# EAGLE board BEP33_12panel stencil (EAGLE 7.7.0), part 1 of 8
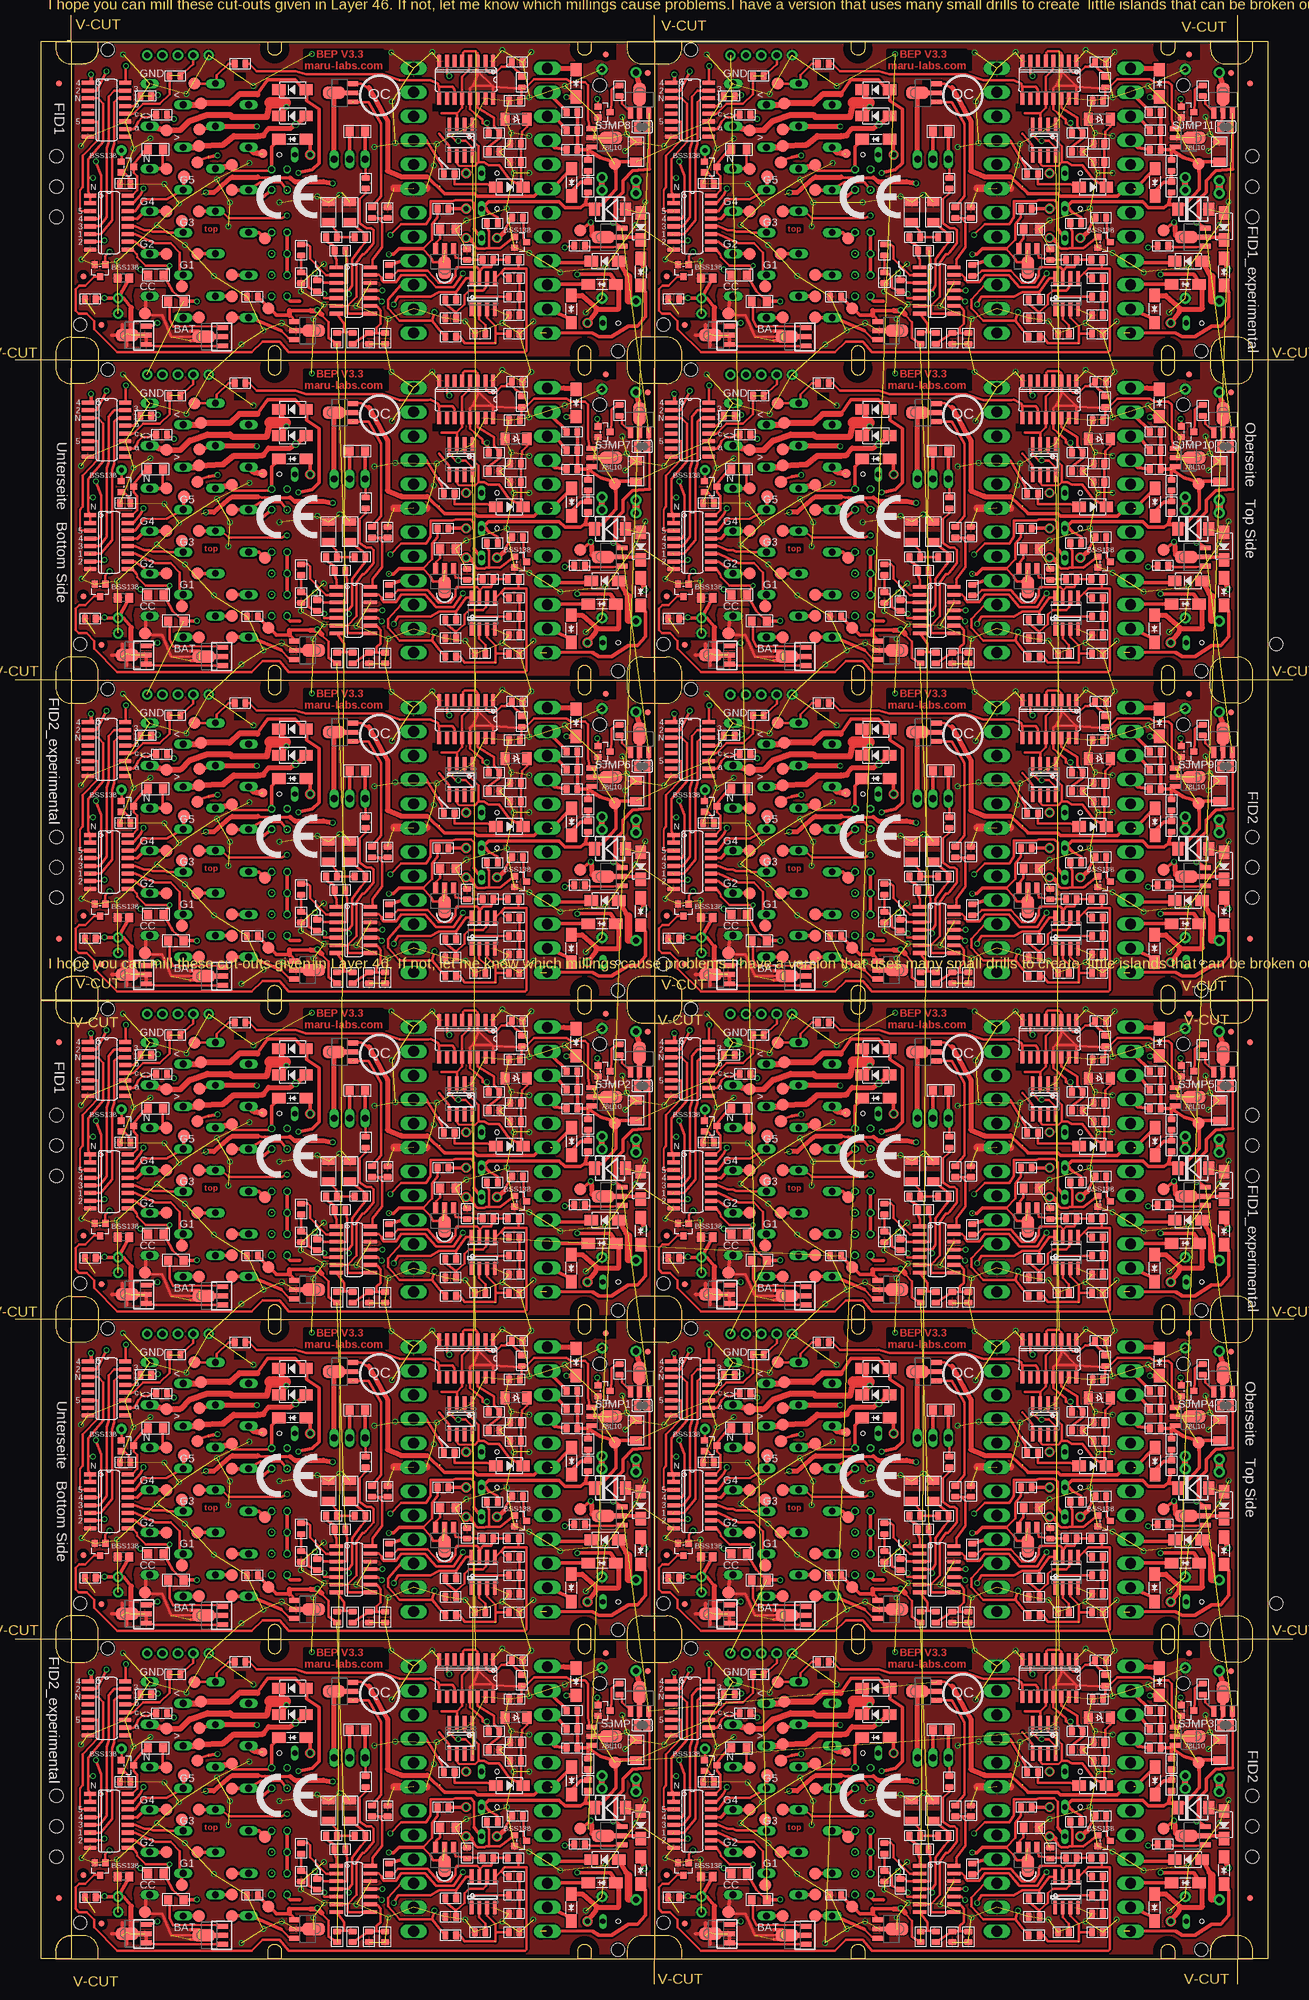
[diagram p26: board, top side]
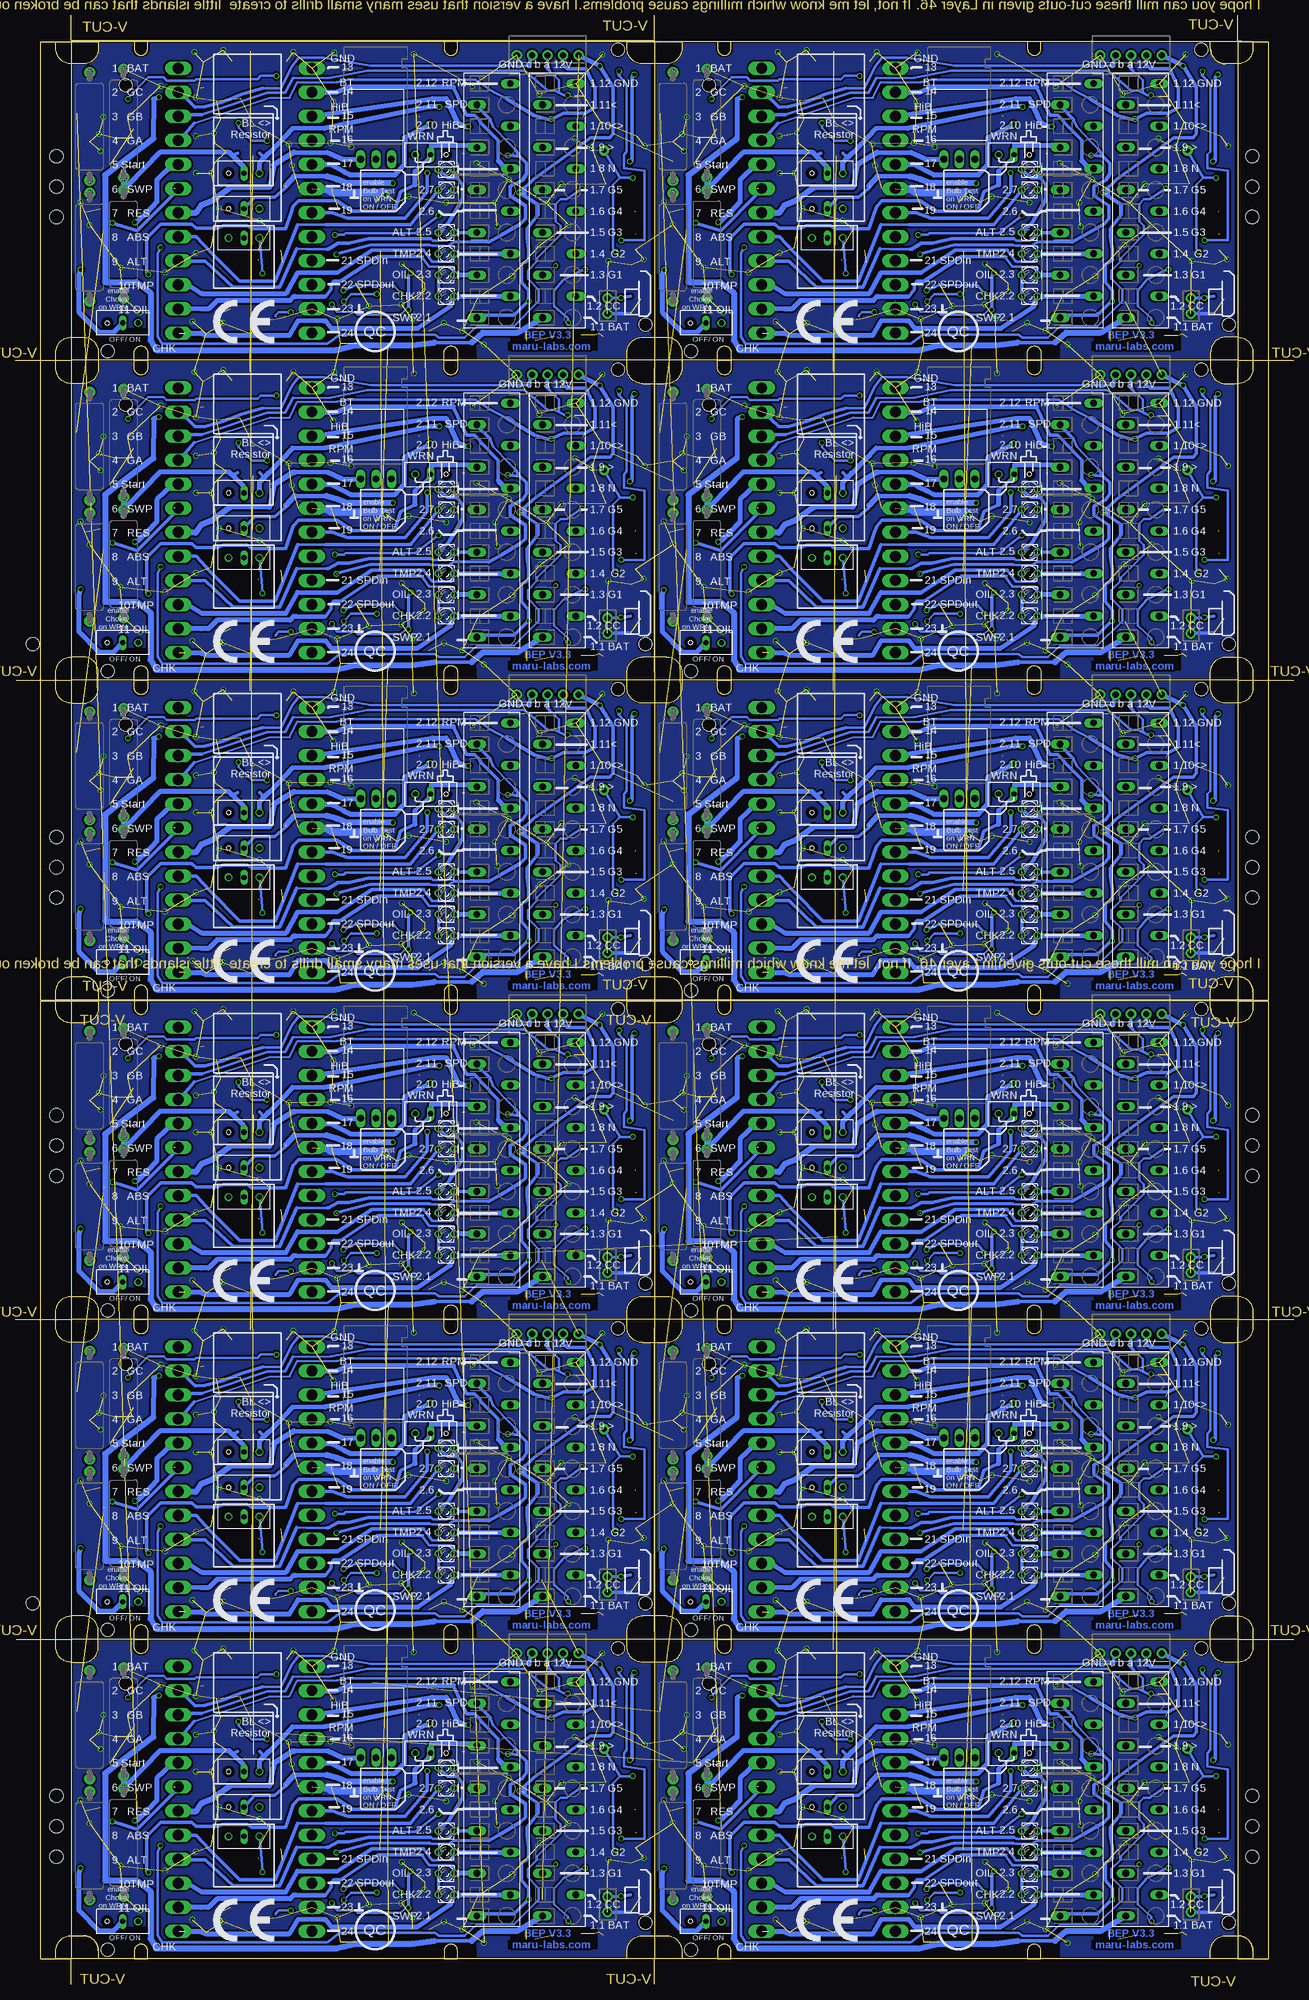
[diagram p27: board, bottom side, seen from below]

Size 210.4 x 324 mm. Coordinates in mm from the lower left corner, seen from the top.
Outline: 87 segments
Copper layers (1*16): Top 0.035mm / dielectric 1.5mm / Bottom 0.035mm
Design rules "Vorlage BEP3 und hoeher multi-cb_035um-cu": minimum track width 6mil, minimum drill 12mil, track to track 12mil, track to pad 12mil, pad to pad 6mil, via to via 6mil, smd to smd 6mil, copper to edge 10mil, drill to drill 8mil, minimum pad ring 8mil, minimum via ring 6mil, stop-mask expansion 3mil, vias tented up to drill 0mil, thermal gap 8mil
Holes 2.18 mm at 10.7,10.1 96.2,49.5 99.2,5.7 15.2,55.3 6.8,143 6.8,21 6.8,26 6.8,138 207.5,62.7 203.6,143 203.6,21 203.6,26 203.6,138 6.8,31 6.8,133 203.6,133 203.6,31 10.7,62.7 96.2,102.1 99.2,58.3 15.2,107.9 10.7,115.3 96.2,154.7 99.2,110.9 15.2,160.5 106.7,10.1 192.2,49.5 195.2,5.7 111.2,55.3 106.7,62.7 192.2,102.1 195.2,58.3 111.2,107.9 106.7,115.3 192.2,154.7 195.2,110.9 111.2,160.5 10.7,167.9 96.2,207.3 99.2,163.5 15.2,213.1 6.8,300.8 6.8,178.8 6.8,183.8 6.8,295.8 207.5,220.5 203.6,300.8 203.6,178.8 203.6,183.8 203.6,295.8 6.8,188.8 6.8,290.8 203.6,290.8 203.6,188.8 10.7,220.5 96.2,259.9 99.2,216.1 15.2,265.7 10.7,273.1 96.2,312.5 99.2,268.7 15.2,318.3 106.7,167.9 192.2,207.3 195.2,163.5 111.2,213.1 106.7,220.5 192.2,259.9 195.2,216.1 111.2,265.7 106.7,273.1 192.2,312.5 195.2,268.7 111.2,318.3
tRestrict: area 50.2,25.2 to 56.7,28.5; area 36,50.2 to 37.9,51.5; area 67.6,20.8 to 69.4,22.8; area 53.3,46.1 to 54.7,50.4; area 46.5,6.9 to 47.8,11.4; area 19.2,6.6 to 20.6,10.1; area 97.6,26.6 to 99.2,27.8; area 95.6,53.7 to 98.9,56.4; area 68.7,45.2 to 72.9,46.4; area 22.6,38.2 to 23.7,39.9; area 16.5,56.8 to 91.2,56.8; area 47.6,52 to 61.3,55.1; 204 more areas
bRestrict: area 18.6,5.8 to 28.8,9.3; area 28.7,5.8 to 33.3,7.3; area 38.5,5.1 to 45,7.3; area 90.8,5.7 to 96.8,9.5; area 41.5,54.3 to 43.9,56.7; area 41.3,55.4 to 44.1,56.8; area 92.5,54.3 to 94.9,56.7; area 92.3,55.4 to 95.1,56.8; area 92.4,4.2 to 95,6.8; area 41.4,4.2 to 44,6.9; area 38.5,4.2 to 45.6,5.9; area 100.8,53.1 to 105,56.8; 156 more areas
Milling: 376 lines

## Footprints (pad centres in the part's own frame; a part is rotated, then mirrored left to right if it is on the bottom)
12-PIN = drill 1.118 long: 1 19.25,-2.45; 2 15.75,3.05; 3 12.25,-2.45; 4 8.75,3.05; 5 5.25,-2.45; 6 1.75,3.05; 7 -1.75,-2.45; 8 -5.25,3.05; 9 -8.75,-2.45; 10 -12.25,3.05; 11 -15.75,-2.45; 12 -19.25,3.05
B2.0 = smd 2 x 2: TP 0,0
C1206 = smd 1.27 x 2.032: 1 -1.651,0; 2 1.651,0
C0805 = smd 1.397 x 1.016: 1 0,0.889; 2 0,-0.889
DO-214AC_SLIM = smd 2.2 x 1.77: 1 -2.242,0; 2 2.242,0
DO-214AC = smd 2.2 x 1.77: 1 -2.242,0; 2 2.242,0
SOD-123_MINI-SMA = smd 1.5 x 2.1: A 1.8,0; C -1.8,0
DO214AA = smd 1.8 x 2.2: A 2.55,0; C -2.55,0
FIDUCIAL_1MM = smd 1 x 1: 1 0,0
FIDUCIAL_1MM_WITH_SOLDERMASK = smd 1 x 1: 1 0,0
SO16 = smd 0.66 x 2.032: 1 -4.445,-3.073; 2 -3.175,-3.073; 3 -1.905,-3.073; 4 -0.635,-3.073; 5 0.635,-3.073; 6 1.905,-3.073; 7 3.175,-3.073; 8 4.445,-3.073; 9 4.445,3.073; 10 3.175,3.073; 11 1.905,3.073; 12 0.635,3.073; 13 -0.635,3.073; 14 -1.905,3.073; 15 -3.175,3.073; 16 -4.445,3.073
TO220H_NOHOLE = drill 1.118 long: 1 -2.54,-10.16; 2 0,-10.16; 3 2.54,-10.16
SO14 = smd 0.6 x 2.2: 1 -3.81,-2.8; 2 -2.54,-2.8; 3 -1.27,-2.8; 4 0,-2.8; 5 1.27,-2.8; 6 2.54,-2.8; 7 3.81,-2.8; 8 3.81,2.8; 9 2.54,2.8; 10 1.27,2.8; 11 0,2.8; 12 -1.27,2.8; 13 -2.54,2.8; 14 -3.81,2.8
SOT89_ROUND = smd 0.8 x 1.8: 1 -1.499,-2.181; 3 1.499,-2.181 | smd 0.8 x 2.3: 2 0,-1.927 | smd 2.032 x 3.65: 2@1 0,0.94
SO08 = smd 0.6 x 2.2: 1 -1.905,-2.6; 2 -0.635,-2.6; 3 0.635,-2.6; 4 1.905,-2.6; 5 1.905,2.6; 6 0.635,2.6; 7 -0.635,2.6; 8 -1.905,2.6
JP2_SMALLPADS = drill 0.85: 1 -2.54,0 | drill 0.85 long: 2 0,0 | hole 0.7: 2.54,0
JP2_ORIG_SMALLPADS = drill 0.85: 1 -2.54,0; 3 2.54,0 | drill 0.85 long: 2 0,0
LD260 = drill 0.813 octagon: A -1.27,0; K 1.27,0
SOT-23 = smd 1.016 x 1.143: 1 -0.889,-1.016; 2 0.889,-1.016; 3 0,1.016
SOT89 = smd 0.8 x 1.8: 1 -1.499,-2.181; 3 1.499,-2.181 | smd 0.8 x 2.3: 2 0,-1.927 | smd 2.032 x 3.65: 2@1 0,0.94
R0805 = smd 1.397 x 1.016: 1 0,0.889; 2 0,-0.889
R1206 = smd 1.27 x 1.524: 1 -1.27,0; 2 1.27,0
V235/17_1MM = drill 1 pad 1.778: 1 -8.89,0; 2 8.89,0
R0805' = smd 1.3 x 1.5: 1 -0.95,0; 2 0.95,0
SJ = smd 1.168 x 1.6: 1 -0.762,0; 2 0.762,0
B1,27 = smd 1.5 x 1.5: TP 0,0
STENCIL_HOLE = smd 2.2 x 2.2: P$1 0,0
24-PIN_V2 = drill 1.778 long: 1 -21.78,-11; 2 -17.82,-11; 3 -13.86,-11; 4 -9.9,-11; 5 -5.94,-11; 6 -1.98,-11; 7 1.98,-11; 8 5.94,-11; 9 9.9,-11; 10 13.86,-11; 11 17.82,-11; 12 21.78,-11; 13 -21.78,11; 14 -17.82,11; 15 -13.86,11; 16 -9.9,11; 17 -5.94,11; 18 -1.98,11; 19 1.98,11; 20 5.94,11; 21 9.9,11; 22 13.86,11; 23 17.82,11; 24 21.78,11
22-23-2051 = drill 1 pad 1.676: 1 -5.08,0; 2 -2.54,0; 3 0,0; 4 2.54,0; 5 5.08,0
22-23-2021 = drill 1 pad 1.676: 1 -1.27,0; 2 1.27,0

## Placement (x,y rotation side)
1  [12-PIN]  25.19,30.5 270 bottom
2  [12-PIN]  35.98,30.5 270 bottom
3  [12-PIN]  25.19,83.1 270 bottom
4  [12-PIN]  35.98,83.1 270 bottom
5  [12-PIN]  25.19,135.7 270 bottom
6  [12-PIN]  35.98,135.7 270 bottom
6V  TPSB2.0  [B2.0]  41.7,12.78 0 top
6V1  TPSB2.0  [B2.0]  41.7,65.38 0 top
6V2  TPSB2.0  [B2.0]  41.7,117.98 0 top
6V3  TPSB2.0  [B2.0]  137.7,12.78 0 top
6V4  TPSB2.0  [B2.0]  137.7,65.38 0 top
6V5  TPSB2.0  [B2.0]  137.7,117.98 0 top
6V6  TPSB2.0  [B2.0]  41.7,170.58 0 top
6V7  TPSB2.0  [B2.0]  41.7,223.18 0 top
6V8  TPSB2.0  [B2.0]  41.7,275.78 0 top
6V9  TPSB2.0  [B2.0]  137.7,170.58 0 top
6V10  TPSB2.0  [B2.0]  137.7,223.18 0 top
6V11  TPSB2.0  [B2.0]  137.7,275.78 0 top
7  [12-PIN]  121.19,30.5 270 bottom
8  [12-PIN]  131.98,30.5 270 bottom
9  [12-PIN]  121.19,83.1 270 bottom
10  [12-PIN]  131.98,83.1 270 bottom
10V  TPSB2.0  [B2.0]  98.7,36.5 0 top
10V1  TPSB2.0  [B2.0]  98.7,89.1 0 top
10V2  TPSB2.0  [B2.0]  98.7,141.7 0 top
10V3  TPSB2.0  [B2.0]  194.7,36.5 0 top
10V4  TPSB2.0  [B2.0]  194.7,89.1 0 top
10V5  TPSB2.0  [B2.0]  194.7,141.7 0 top
10V6  TPSB2.0  [B2.0]  98.7,194.3 0 top
10V7  TPSB2.0  [B2.0]  98.7,246.9 0 top
10V8  TPSB2.0  [B2.0]  98.7,299.5 0 top
10V9  TPSB2.0  [B2.0]  194.7,194.3 0 top
10V10  TPSB2.0  [B2.0]  194.7,246.9 0 top
10V11  TPSB2.0  [B2.0]  194.7,299.5 0 top
11  [12-PIN]  121.19,135.7 270 bottom
12  [12-PIN]  131.98,135.7 270 bottom
13  [12-PIN]  25.19,188.3 270 bottom
14  [12-PIN]  35.98,188.3 270 bottom
15  [12-PIN]  25.19,240.9 270 bottom
16  [12-PIN]  35.98,240.9 270 bottom
17  [12-PIN]  25.19,293.5 270 bottom
18  [12-PIN]  35.98,293.5 270 bottom
19  [12-PIN]  121.19,188.3 270 bottom
20  [12-PIN]  131.98,188.3 270 bottom
21  [12-PIN]  121.19,240.9 270 bottom
22  [12-PIN]  131.98,240.9 270 bottom
23  [12-PIN]  121.19,293.5 270 bottom
24  [12-PIN]  131.98,293.5 270 bottom
C1  100u  [C1206]  51.54,81.19 90 top
C2  10u  [C1206]  102.16,38.56 90 top
C3  100u  [C1206]  55.1,81.19 90 top
C4  100nF,  [C0805]  39.03,67.28 270 top
C5  4.7u  [C0805]  82.1,61.19 90 top
C6  100nF.  [C0805]  58.21,60.43 0 top
C7  100nF.  [C0805]  61.26,81.13 0 top
C8  2.2nF  [C0805]  82.34,89.38 90 top
C9  100nF  [C0805]  82.16,99.55 270 top
C10  100nF  [C0805]  78.78,91.16 90 top
C11  100nF,  [C0805]  82.1,64.24 270 top
C12  4.7u  [C0805]  82.61,105.89 270 top
C13  10u  [C1206]  102.16,91.16 90 top
C14  100u  [C1206]  51.54,133.79 90 top
C15  4.7u  [C0805]  82.61,53.29 270 top
C16  100u  [C1206]  55.1,133.79 90 top
C17  100nF,  [C0805]  39.03,119.88 270 top
C18  4.7u  [C0805]  82.1,113.79 90 top
C19  100nF.  [C0805]  58.21,113.03 0 top
C20  100nF.  [C0805]  61.26,133.73 0 top
C21  2.2nF  [C0805]  82.34,141.98 90 top
C22  100nF  [C0805]  82.16,152.15 270 top
C23  100nF  [C0805]  78.78,143.76 90 top
C24  100nF,  [C0805]  82.1,116.84 270 top
C25  4.7u  [C0805]  82.61,158.49 270 top
C26  10u  [C1206]  102.16,143.76 90 top
C27  100u  [C1206]  147.54,28.59 90 top
C28  100u  [C1206]  151.1,28.59 90 top
C29  100nF,  [C0805]  135.03,14.68 270 top
C30  4.7u  [C0805]  178.1,8.59 90 top
C31  100nF.  [C0805]  154.21,7.83 0 top
C32  100nF.  [C0805]  157.26,28.53 0 top
C33  2.2nF  [C0805]  178.34,36.78 90 top
C34  100nF  [C0805]  178.16,46.95 270 top
C35  100nF  [C0805]  174.78,38.56 90 top
C36  100nF,  [C0805]  178.1,11.64 270 top
C37  4.7u  [C0805]  178.61,53.29 270 top
C38  10u  [C1206]  198.16,38.56 90 top
C39  100u  [C1206]  147.54,81.19 90 top
C40  100u  [C1206]  151.1,81.19 90 top
C41  100nF,  [C0805]  135.03,67.28 270 top
C42  4.7u  [C0805]  178.1,61.19 90 top
C43  100nF.  [C0805]  154.21,60.43 0 top
C44  100nF.  [C0805]  157.26,81.13 0 top
C45  2.2nF  [C0805]  178.34,89.38 90 top
C46  100nF  [C0805]  178.16,99.55 270 top
C47  100nF  [C0805]  174.78,91.16 90 top
C48  100nF,  [C0805]  178.1,64.24 270 top
C49  4.7u  [C0805]  178.61,105.89 270 top
C50  10u  [C1206]  198.16,91.16 90 top
C51  100u  [C1206]  147.54,133.79 90 top
C52  100u  [C1206]  151.1,133.79 90 top
C53  100nF,  [C0805]  135.03,119.88 270 top
C54  4.7u  [C0805]  178.1,113.79 90 top
C55  100nF.  [C0805]  154.21,113.03 0 top
C56  100nF.  [C0805]  157.26,133.73 0 top
C57  2.2nF  [C0805]  178.34,141.98 90 top
C58  100nF  [C0805]  178.16,152.15 270 top
C59  100nF  [C0805]  174.78,143.76 90 top
C60  100nF,  [C0805]  178.1,116.84 270 top
C61  4.7u  [C0805]  178.61,158.49 270 top
C62  10u  [C1206]  198.16,143.76 90 top
C63  100u  [C1206]  51.54,186.39 90 top
C64  100u  [C1206]  55.1,186.39 90 top
C65  100nF,  [C0805]  39.03,172.48 270 top
C66  4.7u  [C0805]  82.1,166.39 90 top
C67  100nF.  [C0805]  58.21,165.63 0 top
C68  100nF.  [C0805]  61.26,186.33 0 top
C69  2.2nF  [C0805]  82.34,194.58 90 top
C70  100nF  [C0805]  82.16,204.75 270 top
C71  100nF  [C0805]  78.78,196.36 90 top
C72  100nF,  [C0805]  82.1,169.44 270 top
C73  4.7u  [C0805]  82.61,211.09 270 top
C74  10u  [C1206]  102.16,196.36 90 top
C75  100u  [C1206]  51.54,238.99 90 top
C76  100u  [C1206]  55.1,238.99 90 top
C77  100nF,  [C0805]  39.03,225.08 270 top
C78  4.7u  [C0805]  82.1,218.99 90 top
C79  100nF.  [C0805]  58.21,218.23 0 top
C80  100nF.  [C0805]  61.26,238.93 0 top
C81  2.2nF  [C0805]  82.34,247.18 90 top
C82  100nF  [C0805]  82.16,257.35 270 top
C83  100nF  [C0805]  78.78,248.96 90 top
C84  100nF,  [C0805]  82.1,222.04 270 top
C85  4.7u  [C0805]  82.61,263.69 270 top
C86  10u  [C1206]  102.16,248.96 90 top
C87  100u  [C1206]  51.54,291.59 90 top
C88  100u  [C1206]  55.1,291.59 90 top
C89  100nF,  [C0805]  39.03,277.68 270 top
C90  4.7u  [C0805]  82.1,271.59 90 top
C91  100nF.  [C0805]  58.21,270.83 0 top
C92  100nF.  [C0805]  61.26,291.53 0 top
C93  2.2nF  [C0805]  82.34,299.78 90 top
C94  100nF  [C0805]  82.16,309.95 270 top
C95  100nF  [C0805]  78.78,301.56 90 top
C96  100nF,  [C0805]  82.1,274.64 270 top
C97  4.7u  [C0805]  82.61,316.29 270 top
C98  10u  [C1206]  102.16,301.56 90 top
C99  100u  [C1206]  147.54,186.39 90 top
C100  100u  [C1206]  151.1,186.39 90 top
C101  4.7u  [C0805]  82.1,8.59 90 top
C102  100nF  [C0805]  82.16,46.95 270 top
C103  100nF,  [C0805]  82.1,11.64 270 top
C104  100nF,  [C0805]  39.03,14.68 270 top
C105  100nF.  [C0805]  58.21,7.83 0 top
C106  100nF.  [C0805]  61.26,28.53 0 top
C107  100u  [C1206]  51.54,28.59 90 top
C108  100u  [C1206]  55.1,28.59 90 top
C109  2.2nF  [C0805]  82.34,36.78 90 top
C110  100nF  [C0805]  78.78,38.56 90 top
C111  100nF,  [C0805]  135.03,172.48 270 top
C112  4.7u  [C0805]  178.1,166.39 90 top
C113  100nF.  [C0805]  154.21,165.63 0 top
C114  100nF.  [C0805]  157.26,186.33 0 top
C115  2.2nF  [C0805]  178.34,194.58 90 top
C116  100nF  [C0805]  178.16,204.75 270 top
C117  100nF  [C0805]  174.78,196.36 90 top
C118  100nF,  [C0805]  178.1,169.44 270 top
C119  4.7u  [C0805]  178.61,211.09 270 top
C120  10u  [C1206]  198.16,196.36 90 top
C121  100u  [C1206]  147.54,238.99 90 top
C122  100u  [C1206]  151.1,238.99 90 top
C123  100nF,  [C0805]  135.03,225.08 270 top
C124  4.7u  [C0805]  178.1,218.99 90 top
C125  100nF.  [C0805]  154.21,218.23 0 top
C126  100nF.  [C0805]  157.26,238.93 0 top
C127  2.2nF  [C0805]  178.34,247.18 90 top
C128  100nF  [C0805]  178.16,257.35 270 top
C129  100nF  [C0805]  174.78,248.96 90 top
C130  100nF,  [C0805]  178.1,222.04 270 top
C131  4.7u  [C0805]  178.61,263.69 270 top
C132  10u  [C1206]  198.16,248.96 90 top
C133  100u  [C1206]  147.54,291.59 90 top
C134  100u  [C1206]  151.1,291.59 90 top
C135  100nF,  [C0805]  135.03,277.68 270 top
C136  4.7u  [C0805]  178.1,271.59 90 top
C137  100nF.  [C0805]  154.21,270.83 0 top
C138  100nF.  [C0805]  157.26,291.53 0 top
C139  2.2nF  [C0805]  178.34,299.78 90 top
C140  100nF  [C0805]  178.16,309.95 270 top
C141  100nF  [C0805]  174.78,301.56 90 top
C142  100nF,  [C0805]  178.1,274.64 270 top
C143  4.7u  [C0805]  178.61,316.29 270 top
C144  10u  [C1206]  198.16,301.56 90 top
D1  SS12  [DO-214AC_SLIM]  91.56,33.49 270 top
D2  SS12  [DO-214AC_SLIM]  92.3,49.78 270 top
D3  1N4007,  [DO-214AC]  45.64,97 180 top
D4  Zen11  [SOD-123_MINI-SMA]  82.4,43.88 180 top
D5  1N4007,  [DO-214AC]  45.64,101.32 180 top
D6  1N4007.  [DO-214AC]  97.07,73.13 180 top
D7  1N5817  [DO-214AC_SLIM]  96.56,69.32 180 top
D8  1N5817.  [DO-214AC_SLIM]  91.5,65.24 270 top
D9  1N5817.  [DO-214AC_SLIM]  102.93,71.35 270 top
D10  1N5817  [DO-214AC_SLIM]  45.64,93.19 180 top
D11  1N4007.  [DO-214AC]  102.93,78.84 270 top
D12  1N4007  [DO-214AC]  81.32,85.32 0 top
D13  Zen15  [DO214AA]  97.89,81.67 0 top
D14  1N4007,  [DO-214AC]  45.64,202.2 180 top
D15  SS12  [DO-214AC_SLIM]  91.56,86.09 270 top
D16  SS12  [DO-214AC_SLIM]  92.3,102.38 270 top
D17  Zen11  [SOD-123_MINI-SMA]  82.4,96.48 180 top
D18  1N4007,  [DO-214AC]  45.64,149.6 180 top
D19  1N4007,  [DO-214AC]  45.64,153.92 180 top
D20  1N4007.  [DO-214AC]  97.07,125.73 180 top
D21  1N5817  [DO-214AC_SLIM]  96.56,121.92 180 top
D22  1N5817.  [DO-214AC_SLIM]  91.5,117.84 270 top
D23  1N5817.  [DO-214AC_SLIM]  102.93,123.95 270 top
D24  1N5817  [DO-214AC_SLIM]  45.64,145.79 180 top
D25  1N4007.  [DO-214AC]  102.93,131.44 270 top
D26  1N4007  [DO-214AC]  81.32,137.92 0 top
D27  Zen15  [DO214AA]  97.89,134.27 0 top
D28  1N4007,  [DO-214AC]  45.64,206.52 180 top
D29  SS12  [DO-214AC_SLIM]  91.56,138.69 270 top
D30  SS12  [DO-214AC_SLIM]  92.3,154.98 270 top
D31  Zen11  [SOD-123_MINI-SMA]  82.4,149.08 180 top
D32  1N4007,  [DO-214AC]  141.64,44.4 180 top
D33  1N4007,  [DO-214AC]  141.64,48.72 180 top
D34  1N4007.  [DO-214AC]  193.07,20.53 180 top
D35  1N5817  [DO-214AC_SLIM]  192.56,16.72 180 top
D36  1N5817.  [DO-214AC_SLIM]  187.5,12.64 270 top
D37  1N5817.  [DO-214AC_SLIM]  198.93,18.75 270 top
D38  1N5817  [DO-214AC_SLIM]  141.64,40.59 180 top
D39  1N4007.  [DO-214AC]  198.93,26.24 270 top
D40  1N4007  [DO-214AC]  177.32,32.72 0 top
D41  Zen15  [DO214AA]  193.89,29.07 0 top
D42  1N4007.  [DO-214AC]  97.07,178.33 180 top
D43  SS12  [DO-214AC_SLIM]  187.56,33.49 270 top
D44  SS12  [DO-214AC_SLIM]  188.3,49.78 270 top
D45  Zen11  [SOD-123_MINI-SMA]  178.4,43.88 180 top
D46  1N4007,  [DO-214AC]  141.64,97 180 top
D47  1N4007,  [DO-214AC]  141.64,101.32 180 top
D48  1N4007.  [DO-214AC]  193.07,73.13 180 top
D49  1N5817  [DO-214AC_SLIM]  192.56,69.32 180 top
D50  1N5817.  [DO-214AC_SLIM]  187.5,65.24 270 top
D51  1N5817.  [DO-214AC_SLIM]  198.93,71.35 270 top
D52  1N5817  [DO-214AC_SLIM]  141.64,93.19 180 top
D53  1N4007.  [DO-214AC]  198.93,78.84 270 top
D54  1N4007  [DO-214AC]  177.32,85.32 0 top
D55  Zen15  [DO214AA]  193.89,81.67 0 top
D56  1N5817  [DO-214AC_SLIM]  96.56,174.52 180 top
D57  SS12  [DO-214AC_SLIM]  187.56,86.09 270 top
D58  SS12  [DO-214AC_SLIM]  188.3,102.38 270 top
D59  Zen11  [SOD-123_MINI-SMA]  178.4,96.48 180 top
D60  1N4007,  [DO-214AC]  141.64,149.6 180 top
D61  1N4007,  [DO-214AC]  141.64,153.92 180 top
D62  1N4007.  [DO-214AC]  193.07,125.73 180 top
D63  1N5817  [DO-214AC_SLIM]  192.56,121.92 180 top
D64  1N5817.  [DO-214AC_SLIM]  187.5,117.84 270 top
D65  1N5817.  [DO-214AC_SLIM]  198.93,123.95 270 top
D66  1N5817  [DO-214AC_SLIM]  141.64,145.79 180 top
D67  1N4007.  [DO-214AC]  198.93,131.44 270 top
D68  1N4007  [DO-214AC]  177.32,137.92 0 top
D69  Zen15  [DO214AA]  193.89,134.27 0 top
D70  1N5817.  [DO-214AC_SLIM]  91.5,170.44 270 top
D71  SS12  [DO-214AC_SLIM]  187.56,138.69 270 top
D72  SS12  [DO-214AC_SLIM]  188.3,154.98 270 top
D73  Zen11  [SOD-123_MINI-SMA]  178.4,149.08 180 top
D74  1N5817.  [DO-214AC_SLIM]  102.93,176.55 270 top
D75  1N5817  [DO-214AC_SLIM]  45.64,198.39 180 top
D76  1N4007.  [DO-214AC]  102.93,184.04 270 top
D77  1N4007  [DO-214AC]  81.32,190.52 0 top
D78  Zen15  [DO214AA]  97.89,186.87 0 top
D79  SS12  [DO-214AC_SLIM]  91.56,191.29 270 top
D80  SS12  [DO-214AC_SLIM]  92.3,207.58 270 top
D81  Zen11  [SOD-123_MINI-SMA]  82.4,201.68 180 top
D82  1N4007,  [DO-214AC]  45.64,254.8 180 top
D83  1N4007,  [DO-214AC]  45.64,259.12 180 top
D84  1N4007.  [DO-214AC]  97.07,230.93 180 top
D85  1N5817  [DO-214AC_SLIM]  96.56,227.12 180 top
D86  1N5817.  [DO-214AC_SLIM]  91.5,223.04 270 top
D87  1N5817.  [DO-214AC_SLIM]  102.93,229.15 270 top
D88  1N5817  [DO-214AC_SLIM]  45.64,250.99 180 top
D89  1N4007.  [DO-214AC]  102.93,236.64 270 top
D90  1N4007  [DO-214AC]  81.32,243.12 0 top
D91  Zen15  [DO214AA]  97.89,239.47 0 top
D92  SS12  [DO-214AC_SLIM]  91.56,243.89 270 top
D93  SS12  [DO-214AC_SLIM]  92.3,260.18 270 top
D94  Zen11  [SOD-123_MINI-SMA]  82.4,254.28 180 top
D95  1N4007,  [DO-214AC]  45.64,307.4 180 top
D96  1N4007,  [DO-214AC]  45.64,311.72 180 top
D97  1N4007.  [DO-214AC]  97.07,283.53 180 top
D98  1N5817  [DO-214AC_SLIM]  96.56,279.72 180 top
D99  1N5817.  [DO-214AC_SLIM]  91.5,275.64 270 top
D100  1N5817.  [DO-214AC_SLIM]  102.93,281.75 270 top
D101  Zen15  [DO214AA]  97.89,29.07 0 top
D102  1N4007,  [DO-214AC]  45.64,44.4 180 top
D103  1N4007,  [DO-214AC]  45.64,48.72 180 top
D104  1N5817  [DO-214AC_SLIM]  45.64,303.59 180 top
D105  1N4007.  [DO-214AC]  102.93,26.24 270 top
D106  1N4007.  [DO-214AC]  97.07,20.53 180 top
D107  1N5817  [DO-214AC_SLIM]  96.56,16.72 180 top
D108  1N5817.  [DO-214AC_SLIM]  91.5,12.64 270 top
D109  1N5817.  [DO-214AC_SLIM]  102.93,18.75 270 top
D110  1N5817  [DO-214AC_SLIM]  45.64,40.59 180 top
D111  1N4007.  [DO-214AC]  102.93,289.24 270 top
D112  1N4007  [DO-214AC]  81.32,32.72 0 top
D113  1N4007  [DO-214AC]  81.32,295.72 0 top
D114  Zen15  [DO214AA]  97.89,292.07 0 top
D115  SS12  [DO-214AC_SLIM]  91.56,296.49 270 top
D116  SS12  [DO-214AC_SLIM]  92.3,312.78 270 top
D117  Zen11  [SOD-123_MINI-SMA]  82.4,306.88 180 top
D118  1N4007,  [DO-214AC]  141.64,202.2 180 top
D119  1N4007,  [DO-214AC]  141.64,206.52 180 top
D120  1N4007.  [DO-214AC]  193.07,178.33 180 top
D121  1N5817  [DO-214AC_SLIM]  192.56,174.52 180 top
D122  1N5817.  [DO-214AC_SLIM]  187.5,170.44 270 top
D123  1N5817.  [DO-214AC_SLIM]  198.93,176.55 270 top
D124  1N5817  [DO-214AC_SLIM]  141.64,198.39 180 top
D125  1N4007.  [DO-214AC]  198.93,184.04 270 top
D126  1N4007  [DO-214AC]  177.32,190.52 0 top
D127  Zen15  [DO214AA]  193.89,186.87 0 top
D128  SS12  [DO-214AC_SLIM]  187.56,191.29 270 top
D129  SS12  [DO-214AC_SLIM]  188.3,207.58 270 top
D130  Zen11  [SOD-123_MINI-SMA]  178.4,201.68 180 top
D131  1N4007,  [DO-214AC]  141.64,254.8 180 top
D132  1N4007,  [DO-214AC]  141.64,259.12 180 top
D133  1N4007.  [DO-214AC]  193.07,230.93 180 top
D134  1N5817  [DO-214AC_SLIM]  192.56,227.12 180 top
D135  1N5817.  [DO-214AC_SLIM]  187.5,223.04 270 top
D136  1N5817.  [DO-214AC_SLIM]  198.93,229.15 270 top
D137  1N5817  [DO-214AC_SLIM]  141.64,250.99 180 top
D138  1N4007.  [DO-214AC]  198.93,236.64 270 top
D139  1N4007  [DO-214AC]  177.32,243.12 0 top
D140  Zen15  [DO214AA]  193.89,239.47 0 top
D141  SS12  [DO-214AC_SLIM]  187.56,243.89 270 top
D142  SS12  [DO-214AC_SLIM]  188.3,260.18 270 top
D143  Zen11  [SOD-123_MINI-SMA]  178.4,254.28 180 top
D144  1N4007,  [DO-214AC]  141.64,307.4 180 top
D145  1N4007,  [DO-214AC]  141.64,311.72 180 top
D146  1N4007.  [DO-214AC]  193.07,283.53 180 top
D147  1N5817  [DO-214AC_SLIM]  192.56,279.72 180 top
D148  1N5817.  [DO-214AC_SLIM]  187.5,275.64 270 top
D149  1N5817.  [DO-214AC_SLIM]  198.93,281.75 270 top
D150  1N5817  [DO-214AC_SLIM]  141.64,303.59 180 top
D151  1N4007.  [DO-214AC]  198.93,289.24 270 top
D152  1N4007  [DO-214AC]  177.32,295.72 0 top
D153  Zen15  [DO214AA]  193.89,292.07 0 top
D154  SS12  [DO-214AC_SLIM]  187.56,296.49 270 top
D155  SS12  [DO-214AC_SLIM]  188.3,312.78 270 top
D156  Zen11  [SOD-123_MINI-SMA]  178.4,306.88 180 top
FID1  FIDUCIAL  [FIDUCIAL_1MM]  7.2,155 0 top
FID1B  FIDUCIALFIDUCIAL_1MM_WITH_SOLDERMASK  [FIDUCIAL_1MM_WITH_SOLDERMASK]  203.2,155 0 top
FID1B1  FIDUCIALFIDUCIAL_1MM_WITH_SOLDERMASK  [FIDUCIAL_1MM_WITH_SOLDERMASK]  203.2,312.8 0 top
FID2  FIDUCIAL  [FIDUCIAL_1MM]  203.2,14.2 0 top
FID2B  FIDUCIALFIDUCIAL_1MM_WITH_SOLDERMASK  [FIDUCIAL_1MM_WITH_SOLDERMASK]  7.2,14.2 0 top
FID2B1  FIDUCIALFIDUCIAL_1MM_WITH_SOLDERMASK  [FIDUCIAL_1MM_WITH_SOLDERMASK]  7.2,172 0 top
FID3  FIDUCIAL  [FIDUCIAL_1MM]  97.2,107.1 0 top
FID4  FIDUCIAL  [FIDUCIAL_1MM]  11.2,70.6 0 top
FID5  FIDUCIAL  [FIDUCIAL_1MM]  14.2,62.6 0 top
FID6  FIDUCIAL  [FIDUCIAL_1MM]  104.1,104.1 0 top
FID7  FIDUCIAL  [FIDUCIAL_1MM]  97.2,159.7 0 top
FID8  FIDUCIAL  [FIDUCIAL_1MM]  11.2,123.2 0 top
FID9  FIDUCIAL  [FIDUCIAL_1MM]  14.2,115.2 0 top
FID10  FIDUCIAL  [FIDUCIAL_1MM]  104.1,156.7 0 top
FID11  FIDUCIAL  [FIDUCIAL_1MM]  193.2,54.5 0 top
FID12  FIDUCIAL  [FIDUCIAL_1MM]  107.2,18 0 top
FID13  FIDUCIAL  [FIDUCIAL_1MM]  110.2,10 0 top
FID14  FIDUCIAL  [FIDUCIAL_1MM]  200.1,51.5 0 top
FID15  FIDUCIAL  [FIDUCIAL_1MM]  193.2,107.1 0 top
FID16  FIDUCIAL  [FIDUCIAL_1MM]  107.2,70.6 0 top
FID17  FIDUCIAL  [FIDUCIAL_1MM]  110.2,62.6 0 top
FID18  FIDUCIAL  [FIDUCIAL_1MM]  200.1,104.1 0 top
FID19  FIDUCIAL  [FIDUCIAL_1MM]  193.2,159.7 0 top
FID20  FIDUCIAL  [FIDUCIAL_1MM]  107.2,123.2 0 top
FID21  FIDUCIAL  [FIDUCIAL_1MM]  110.2,115.2 0 top
FID22  FIDUCIAL  [FIDUCIAL_1MM]  200.1,156.7 0 top
FID23  FIDUCIAL  [FIDUCIAL_1MM]  7.2,312.8 0 top
FID24  FIDUCIAL  [FIDUCIAL_1MM]  203.2,172 0 top
FID25  FIDUCIAL  [FIDUCIAL_1MM]  97.2,212.3 0 top
FID26  FIDUCIAL  [FIDUCIAL_1MM]  11.2,175.8 0 top
FID27  FIDUCIAL  [FIDUCIAL_1MM]  14.2,167.8 0 top
FID28  FIDUCIAL  [FIDUCIAL_1MM]  104.1,209.3 0 top
FID29  FIDUCIAL  [FIDUCIAL_1MM]  97.2,264.9 0 top
FID30  FIDUCIAL  [FIDUCIAL_1MM]  11.2,228.4 0 top
FID31  FIDUCIAL  [FIDUCIAL_1MM]  14.2,220.4 0 top
FID32  FIDUCIAL  [FIDUCIAL_1MM]  104.1,261.9 0 top
FID33  FIDUCIAL  [FIDUCIAL_1MM]  97.2,317.5 0 top
FID34  FIDUCIAL  [FIDUCIAL_1MM]  11.2,281 0 top
FID35  FIDUCIAL  [FIDUCIAL_1MM]  14.2,273 0 top
FID36  FIDUCIAL  [FIDUCIAL_1MM]  104.1,314.5 0 top
FID37  FIDUCIAL  [FIDUCIAL_1MM]  193.2,212.3 0 top
FID38  FIDUCIAL  [FIDUCIAL_1MM]  107.2,175.8 0 top
FID39  FIDUCIAL  [FIDUCIAL_1MM]  110.2,167.8 0 top
FID40  FIDUCIAL  [FIDUCIAL_1MM]  200.1,209.3 0 top
FID41  FIDUCIAL  [FIDUCIAL_1MM]  193.2,264.9 0 top
FID42  FIDUCIAL  [FIDUCIAL_1MM]  107.2,228.4 0 top
FID43  FIDUCIAL  [FIDUCIAL_1MM]  110.2,220.4 0 top
FID44  FIDUCIAL  [FIDUCIAL_1MM]  200.1,261.9 0 top
FID45  FIDUCIAL  [FIDUCIAL_1MM]  193.2,317.5 0 top
FID46  FIDUCIAL  [FIDUCIAL_1MM]  107.2,281 0 top
FID47  FIDUCIAL  [FIDUCIAL_1MM]  110.2,273 0 top
FID48  FIDUCIAL  [FIDUCIAL_1MM]  200.1,314.5 0 top
FID101  FIDUCIAL  [FIDUCIAL_1MM]  97.2,54.5 0 top
FID102  FIDUCIAL  [FIDUCIAL_1MM]  11.2,18 0 top
FID103  FIDUCIAL  [FIDUCIAL_1MM]  14.2,10 0 top
FID104  FIDUCIAL  [FIDUCIAL_1MM]  104.1,51.5 0 top
IC1  4028  [SO16]  15.03,98.02 270 top
IC2  317TO202H_NOHOLE  [TO220H_NOHOLE]  55.03,100.05 0 bottom
IC3  ULN2004  [SO16]  15.43,79.48 270 top
IC4  LM339  [SO14]  55.67,68.3 270 top
IC5  78L06  [SOT89_ROUND]  48.18,61.7 270 top
IC6  555  [SO08]  73.32,93.06 180 top
IC7  4538  [SO16]  74.21,102.97 180 top
IC8  78L10  [SOT89_ROUND]  97.11,93.42 270 top
IC9  LM2904  [SO08]  77.01,67.79 0 top
IC10  4028  [SO16]  15.03,150.62 270 top
IC11  317TO202H_NOHOLE  [TO220H_NOHOLE]  55.03,152.65 0 bottom
IC12  ULN2004  [SO16]  15.43,132.08 270 top
IC13  LM339  [SO14]  55.67,120.9 270 top
IC14  78L06  [SOT89_ROUND]  48.18,114.3 270 top
IC15  555  [SO08]  73.32,145.66 180 top
IC16  4538  [SO16]  74.21,155.57 180 top
IC17  78L10  [SOT89_ROUND]  97.11,146.02 270 top
IC18  LM2904  [SO08]  77.01,120.39 0 top
IC19  4028  [SO16]  111.03,45.42 270 top
IC20  317TO202H_NOHOLE  [TO220H_NOHOLE]  151.03,47.45 0 bottom
IC21  ULN2004  [SO16]  111.43,26.88 270 top
IC22  LM339  [SO14]  151.67,15.7 270 top
IC23  78L06  [SOT89_ROUND]  144.18,9.1 270 top
IC24  555  [SO08]  169.32,40.47 180 top
IC25  4538  [SO16]  170.21,50.37 180 top
IC26  78L10  [SOT89_ROUND]  193.11,40.82 270 top
IC27  LM2904  [SO08]  173.01,15.19 0 top
IC28  4028  [SO16]  111.03,98.02 270 top
IC29  317TO202H_NOHOLE  [TO220H_NOHOLE]  151.03,100.05 0 bottom
IC30  ULN2004  [SO16]  111.43,79.48 270 top
IC31  LM339  [SO14]  151.67,68.3 270 top
IC32  78L06  [SOT89_ROUND]  144.18,61.7 270 top
IC33  555  [SO08]  169.32,93.06 180 top
IC34  4538  [SO16]  170.21,102.97 180 top
IC35  78L10  [SOT89_ROUND]  193.11,93.42 270 top
IC36  LM2904  [SO08]  173.01,67.79 0 top
IC37  4028  [SO16]  111.03,150.62 270 top
IC38  317TO202H_NOHOLE  [TO220H_NOHOLE]  151.03,152.65 0 bottom
IC39  ULN2004  [SO16]  111.43,132.08 270 top
IC40  LM339  [SO14]  151.67,120.9 270 top
IC41  78L06  [SOT89_ROUND]  144.18,114.3 270 top
IC42  555  [SO08]  169.32,145.66 180 top
IC43  4538  [SO16]  170.21,155.57 180 top
IC44  78L10  [SOT89_ROUND]  193.11,146.02 270 top
IC45  LM2904  [SO08]  173.01,120.39 0 top
IC46  4028  [SO16]  15.03,203.22 270 top
IC47  317TO202H_NOHOLE  [TO220H_NOHOLE]  55.03,205.25 0 bottom
IC48  ULN2004  [SO16]  15.43,184.68 270 top
IC49  LM339  [SO14]  55.67,173.5 270 top
IC50  78L06  [SOT89_ROUND]  48.18,166.9 270 top
IC51  555  [SO08]  73.32,198.26 180 top
IC52  4538  [SO16]  74.21,208.17 180 top
IC53  78L10  [SOT89_ROUND]  97.11,198.62 270 top
IC54  LM2904  [SO08]  77.01,172.99 0 top
IC55  4028  [SO16]  15.03,255.82 270 top
IC56  317TO202H_NOHOLE  [TO220H_NOHOLE]  55.03,257.85 0 bottom
IC57  ULN2004  [SO16]  15.43,237.28 270 top
IC58  LM339  [SO14]  55.67,226.1 270 top
IC59  78L06  [SOT89_ROUND]  48.18,219.5 270 top
IC60  555  [SO08]  73.32,250.87 180 top
IC61  4538  [SO16]  74.21,260.77 180 top
IC62  78L10  [SOT89_ROUND]  97.11,251.22 270 top
IC63  LM2904  [SO08]  77.01,225.59 0 top
IC64  4028  [SO16]  15.03,308.42 270 top
IC65  317TO202H_NOHOLE  [TO220H_NOHOLE]  55.03,310.45 0 bottom
IC66  ULN2004  [SO16]  15.43,289.88 270 top
IC67  LM339  [SO14]  55.67,278.7 270 top
IC68  78L06  [SOT89_ROUND]  48.18,272.1 270 top
IC69  555  [SO08]  73.32,303.46 180 top
IC70  4538  [SO16]  74.21,313.37 180 top
IC71  78L10  [SOT89_ROUND]  97.11,303.82 270 top
IC72  LM2904  [SO08]  77.01,278.19 0 top
IC73  4028  [SO16]  111.03,203.22 270 top
IC74  317TO202H_NOHOLE  [TO220H_NOHOLE]  151.03,205.25 0 bottom
IC75  ULN2004  [SO16]  111.43,184.68 270 top
IC76  LM339  [SO14]  151.67,173.5 270 top
IC77  78L06  [SOT89_ROUND]  144.18,166.9 270 top
IC78  555  [SO08]  169.32,198.26 180 top
IC79  4538  [SO16]  170.21,208.17 180 top
IC80  78L10  [SOT89_ROUND]  193.11,198.62 270 top
IC81  LM2904  [SO08]  173.01,172.99 0 top
IC82  4028  [SO16]  111.03,255.82 270 top
IC83  317TO202H_NOHOLE  [TO220H_NOHOLE]  151.03,257.85 0 bottom
IC84  ULN2004  [SO16]  111.43,237.28 270 top
IC85  LM339  [SO14]  151.67,226.1 270 top
IC86  78L06  [SOT89_ROUND]  144.18,219.5 270 top
IC87  555  [SO08]  169.32,250.87 180 top
IC88  4538  [SO16]  170.21,260.77 180 top
IC89  78L10  [SOT89_ROUND]  193.11,251.22 270 top
IC90  LM2904  [SO08]  173.01,225.59 0 top
IC91  4028  [SO16]  111.03,308.42 270 top
IC92  317TO202H_NOHOLE  [TO220H_NOHOLE]  151.03,310.45 0 bottom
IC93  ULN2004  [SO16]  111.43,289.88 270 top
IC94  LM339  [SO14]  151.67,278.7 270 top
IC95  78L06  [SOT89_ROUND]  144.18,272.1 270 top
IC96  555  [SO08]  169.32,303.46 180 top
IC97  4538  [SO16]  170.21,313.37 180 top
IC98  78L10  [SOT89_ROUND]  193.11,303.82 270 top
IC99  LM2904  [SO08]  173.01,278.19 0 top
IC101  LM2904  [SO08]  77.01,15.19 0 top
IC102  78L06  [SOT89_ROUND]  48.18,9.1 270 top
IC104  78L10  [SOT89_ROUND]  97.11,40.82 270 top
IC105  4028  [SO16]  15.03,45.42 270 top
IC107  ULN2004  [SO16]  15.43,26.88 270 top
IC108  LM339  [SO14]  55.67,15.7 270 top
IC109  317TO202H_NOHOLE  [TO220H_NOHOLE]  55.03,47.45 0 bottom
IC110  555  [SO08]  73.32,40.47 180 top
IC111  4538  [SO16]  74.21,50.37 180 top
JP1  [JP2_SMALLPADS]  76.75,81.76 180 bottom
JP2  JP2E_ORIG  [JP2_ORIG_SMALLPADS]  76.75,76.94 180 bottom
JP3  [JP2_SMALLPADS]  96.7,62.95 180 bottom
JP4  [JP2_SMALLPADS]  46.02,90.65 0 bottom
JP5  [JP2_SMALLPADS]  76.75,87.6 180 bottom
JP6  [JP2_SMALLPADS]  76.75,134.36 180 bottom
JP7  JP2E_ORIG  [JP2_ORIG_SMALLPADS]  76.75,129.54 180 bottom
JP8  [JP2_SMALLPADS]  96.7,115.55 180 bottom
JP9  [JP2_SMALLPADS]  46.02,143.25 0 bottom
JP10  [JP2_SMALLPADS]  76.75,140.2 180 bottom
JP11  [JP2_SMALLPADS]  172.75,29.16 180 bottom
JP12  JP2E_ORIG  [JP2_ORIG_SMALLPADS]  172.75,24.34 180 bottom
JP13  [JP2_SMALLPADS]  192.7,10.35 180 bottom
JP14  [JP2_SMALLPADS]  142.02,38.05 0 bottom
JP15  [JP2_SMALLPADS]  172.75,35 180 bottom
JP16  [JP2_SMALLPADS]  172.75,81.76 180 bottom
JP17  JP2E_ORIG  [JP2_ORIG_SMALLPADS]  172.75,76.94 180 bottom
JP18  [JP2_SMALLPADS]  192.7,62.95 180 bottom
JP19  [JP2_SMALLPADS]  142.02,90.65 0 bottom
JP20  [JP2_SMALLPADS]  172.75,87.6 180 bottom
JP21  [JP2_SMALLPADS]  172.75,134.36 180 bottom
JP22  JP2E_ORIG  [JP2_ORIG_SMALLPADS]  172.75,129.54 180 bottom
JP23  [JP2_SMALLPADS]  192.7,115.55 180 bottom
JP24  [JP2_SMALLPADS]  142.02,143.25 0 bottom
JP25  [JP2_SMALLPADS]  172.75,140.2 180 bottom
JP26  [JP2_SMALLPADS]  76.75,186.96 180 bottom
JP27  JP2E_ORIG  [JP2_ORIG_SMALLPADS]  76.75,182.14 180 bottom
JP28  [JP2_SMALLPADS]  96.7,168.15 180 bottom
JP29  [JP2_SMALLPADS]  46.02,195.85 0 bottom
JP30  [JP2_SMALLPADS]  76.75,192.8 180 bottom
JP31  [JP2_SMALLPADS]  76.75,239.56 180 bottom
JP32  JP2E_ORIG  [JP2_ORIG_SMALLPADS]  76.75,234.74 180 bottom
JP33  [JP2_SMALLPADS]  96.7,220.75 180 bottom
JP34  [JP2_SMALLPADS]  46.02,248.45 0 bottom
JP35  [JP2_SMALLPADS]  76.75,245.4 180 bottom
JP36  [JP2_SMALLPADS]  76.75,292.16 180 bottom
JP37  JP2E_ORIG  [JP2_ORIG_SMALLPADS]  76.75,287.34 180 bottom
JP38  [JP2_SMALLPADS]  96.7,273.35 180 bottom
JP39  [JP2_SMALLPADS]  46.02,301.05 0 bottom
JP40  [JP2_SMALLPADS]  76.75,298 180 bottom
JP41  [JP2_SMALLPADS]  172.75,186.96 180 bottom
JP42  JP2E_ORIG  [JP2_ORIG_SMALLPADS]  172.75,182.14 180 bottom
JP43  [JP2_SMALLPADS]  192.7,168.15 180 bottom
JP44  [JP2_SMALLPADS]  142.02,195.85 0 bottom
JP45  [JP2_SMALLPADS]  172.75,192.8 180 bottom
JP46  [JP2_SMALLPADS]  172.75,239.56 180 bottom
JP47  JP2E_ORIG  [JP2_ORIG_SMALLPADS]  172.75,234.74 180 bottom
JP48  [JP2_SMALLPADS]  192.7,220.75 180 bottom
JP49  [JP2_SMALLPADS]  142.02,248.45 0 bottom
JP50  [JP2_SMALLPADS]  172.75,245.4 180 bottom
JP51  [JP2_SMALLPADS]  172.75,292.16 180 bottom
JP52  JP2E_ORIG  [JP2_ORIG_SMALLPADS]  172.75,287.34 180 bottom
JP53  [JP2_SMALLPADS]  192.7,273.35 180 bottom
JP54  [JP2_SMALLPADS]  142.02,301.05 0 bottom
JP55  [JP2_SMALLPADS]  172.75,298 180 bottom
JP101  [JP2_SMALLPADS]  76.75,29.16 180 bottom
JP102  [JP2_SMALLPADS]  96.7,10.35 180 bottom
JP103  [JP2_SMALLPADS]  46.02,38.05 0 bottom
JP104  [JP2_SMALLPADS]  76.75,35 180 bottom
JP105  JP2E_ORIG  [JP2_ORIG_SMALLPADS]  76.75,24.34 180 bottom
LED1  [LD260]  43.48,67.35 0 bottom
LED2  [LD260]  43.48,70.85 0 bottom
LED3  [LD260]  43.48,74.35 0 bottom
LED4  [LD260]  43.48,77.85 0 bottom
LED5  [LD260]  43.48,84.85 0 bottom
LED6  [LD260]  43.48,88.22 0 bottom
LED7  [LD260]  43.48,119.95 0 bottom
LED8  [LD260]  43.48,123.45 0 bottom
LED9  [LD260]  43.48,126.95 0 bottom
LED10  [LD260]  43.48,130.45 0 bottom
LED11  [LD260]  43.48,137.45 0 bottom
LED12  [LD260]  43.48,140.82 0 bottom
LED13  [LD260]  139.48,14.75 0 bottom
LED14  [LD260]  139.48,18.25 0 bottom
LED15  [LD260]  139.48,21.75 0 bottom
LED16  [LD260]  139.48,25.25 0 bottom
LED17  [LD260]  139.48,32.25 0 bottom
LED18  [LD260]  139.48,35.62 0 bottom
LED19  [LD260]  139.48,67.35 0 bottom
LED20  [LD260]  139.48,70.85 0 bottom
LED21  [LD260]  139.48,74.35 0 bottom
LED22  [LD260]  139.48,77.85 0 bottom
LED23  [LD260]  139.48,84.85 0 bottom
LED24  [LD260]  139.48,88.22 0 bottom
LED25  [LD260]  139.48,119.95 0 bottom
LED26  [LD260]  139.48,123.45 0 bottom
LED27  [LD260]  139.48,126.95 0 bottom
LED28  [LD260]  139.48,130.45 0 bottom
LED29  [LD260]  139.48,137.45 0 bottom
LED30  [LD260]  139.48,140.82 0 bottom
LED31  [LD260]  43.48,172.55 0 bottom
LED32  [LD260]  43.48,176.05 0 bottom
LED33  [LD260]  43.48,179.55 0 bottom
LED34  [LD260]  43.48,183.05 0 bottom
LED35  [LD260]  43.48,190.05 0 bottom
LED36  [LD260]  43.48,193.42 0 bottom
LED37  [LD260]  43.48,225.15 0 bottom
LED38  [LD260]  43.48,228.65 0 bottom
LED39  [LD260]  43.48,232.15 0 bottom
LED40  [LD260]  43.48,235.65 0 bottom
LED41  [LD260]  43.48,242.65 0 bottom
LED42  [LD260]  43.48,246.02 0 bottom
LED43  [LD260]  43.48,277.75 0 bottom
LED44  [LD260]  43.48,281.25 0 bottom
LED45  [LD260]  43.48,284.75 0 bottom
LED46  [LD260]  43.48,288.25 0 bottom
LED47  [LD260]  43.48,295.25 0 bottom
LED48  [LD260]  43.48,298.62 0 bottom
LED49  [LD260]  139.48,172.55 0 bottom
LED50  [LD260]  139.48,176.05 0 bottom
LED51  [LD260]  139.48,179.55 0 bottom
LED52  [LD260]  139.48,183.05 0 bottom
LED53  [LD260]  139.48,190.05 0 bottom
LED54  [LD260]  139.48,193.42 0 bottom
LED55  [LD260]  139.48,225.15 0 bottom
LED56  [LD260]  139.48,228.65 0 bottom
LED57  [LD260]  139.48,232.15 0 bottom
LED58  [LD260]  139.48,235.65 0 bottom
LED59  [LD260]  139.48,242.65 0 bottom
LED60  [LD260]  139.48,246.02 0 bottom
LED61  [LD260]  139.48,277.75 0 bottom
LED62  [LD260]  139.48,281.25 0 bottom
LED63  [LD260]  139.48,284.75 0 bottom
LED64  [LD260]  139.48,288.25 0 bottom
LED65  [LD260]  139.48,295.25 0 bottom
LED66  [LD260]  139.48,298.62 0 bottom
LED101  [LD260]  43.48,32.25 0 bottom
LED102  [LD260]  43.48,14.75 0 bottom
LED103  [LD260]  43.48,18.25 0 bottom
LED104  [LD260]  43.48,21.75 0 bottom
LED105  [LD260]  43.48,25.25 0 bottom
LED106  [LD260]  43.48,35.62 0 bottom
Q1  J1  [SOT-23]  13.97,18.96 180 top
Q2  BA  [SOT89]  102.77,47.08 0 top
Q3  J1  [SOT-23]  96.9,45.05 270 top
Q4  BA  [SOT89]  97.64,77.06 90 top
Q5  BA.  [SOT89]  19.35,60.93 90 top
Q6  BA.  [SOT89]  31.93,60.68 90 top
Q7  BA  [SOT89]  53.38,100.81 90 top
Q8  MY  [SOT89]  70.66,73 180 top
Q9  J1  [SOT-23]  83.17,76.24 270 top
Q10  J1  [SOT-23]  18.46,88.62 270 top
Q11  J1  [SOT-23]  13.97,71.56 180 top
Q12  BA  [SOT89]  102.77,99.68 0 top
Q13  J1  [SOT-23]  96.9,97.65 270 top
Q14  BA  [SOT89]  97.64,129.66 90 top
Q15  BA.  [SOT89]  19.35,113.53 90 top
Q16  BA.  [SOT89]  31.93,113.28 90 top
Q17  BA  [SOT89]  53.38,153.41 90 top
Q18  MY  [SOT89]  70.66,125.6 180 top
Q19  J1  [SOT-23]  83.17,128.84 270 top
Q20  J1  [SOT-23]  18.46,141.22 270 top
Q21  J1  [SOT-23]  13.97,124.16 180 top
Q22  BA  [SOT89]  102.77,152.28 0 top
Q23  J1  [SOT-23]  96.9,150.25 270 top
Q24  BA  [SOT89]  193.64,24.46 90 top
Q25  BA.  [SOT89]  115.35,8.33 90 top
Q26  BA.  [SOT89]  127.93,8.08 90 top
Q27  BA  [SOT89]  149.38,48.21 90 top
Q28  MY  [SOT89]  166.66,20.4 180 top
Q29  J1  [SOT-23]  179.17,23.64 270 top
Q30  J1  [SOT-23]  114.46,36.02 270 top
Q31  J1  [SOT-23]  109.97,18.96 180 top
Q32  BA  [SOT89]  198.77,47.08 0 top
Q33  J1  [SOT-23]  192.9,45.05 270 top
Q34  BA  [SOT89]  193.64,77.06 90 top
Q35  BA.  [SOT89]  115.35,60.93 90 top
Q36  BA.  [SOT89]  127.93,60.68 90 top
Q37  BA  [SOT89]  149.38,100.81 90 top
Q38  MY  [SOT89]  166.66,73 180 top
Q39  J1  [SOT-23]  179.17,76.24 270 top
Q40  J1  [SOT-23]  114.46,88.62 270 top
Q41  J1  [SOT-23]  109.97,71.56 180 top
Q42  BA  [SOT89]  198.77,99.68 0 top
Q43  J1  [SOT-23]  192.9,97.65 270 top
Q44  BA  [SOT89]  193.64,129.66 90 top
Q45  BA.  [SOT89]  115.35,113.53 90 top
Q46  BA.  [SOT89]  127.93,113.28 90 top
Q47  BA  [SOT89]  149.38,153.41 90 top
Q48  MY  [SOT89]  166.66,125.6 180 top
Q49  J1  [SOT-23]  179.17,128.84 270 top
Q50  J1  [SOT-23]  114.46,141.22 270 top
Q51  J1  [SOT-23]  109.97,124.16 180 top
Q52  BA  [SOT89]  198.77,152.28 0 top
Q53  J1  [SOT-23]  192.9,150.25 270 top
Q54  BA  [SOT89]  97.64,182.26 90 top
Q55  BA.  [SOT89]  19.35,166.13 90 top
Q56  BA.  [SOT89]  31.93,165.88 90 top
Q57  BA  [SOT89]  53.38,206.01 90 top
Q58  MY  [SOT89]  70.66,178.2 180 top
Q59  J1  [SOT-23]  83.17,181.44 270 top
Q60  J1  [SOT-23]  18.46,193.82 270 top
Q61  J1  [SOT-23]  13.97,176.76 180 top
Q62  BA  [SOT89]  102.77,204.88 0 top
Q63  J1  [SOT-23]  96.9,202.85 270 top
Q64  BA  [SOT89]  97.64,234.86 90 top
Q65  BA.  [SOT89]  19.35,218.73 90 top
Q66  BA.  [SOT89]  31.93,218.48 90 top
Q67  BA  [SOT89]  53.38,258.61 90 top
Q68  MY  [SOT89]  70.66,230.8 180 top
Q69  J1  [SOT-23]  83.17,234.04 270 top
Q70  J1  [SOT-23]  18.46,246.42 270 top
Q71  J1  [SOT-23]  13.97,229.36 180 top
Q72  BA  [SOT89]  102.77,257.48 0 top
Q73  J1  [SOT-23]  96.9,255.45 270 top
Q74  BA  [SOT89]  97.64,287.46 90 top
Q75  BA.  [SOT89]  19.35,271.33 90 top
Q76  BA.  [SOT89]  31.93,271.08 90 top
Q77  BA  [SOT89]  53.38,311.21 90 top
Q78  MY  [SOT89]  70.66,283.4 180 top
Q79  J1  [SOT-23]  83.17,286.64 270 top
Q80  J1  [SOT-23]  18.46,299.02 270 top
Q81  J1  [SOT-23]  13.97,281.96 180 top
Q82  BA  [SOT89]  102.77,310.08 0 top
Q83  J1  [SOT-23]  96.9,308.05 270 top
Q84  BA  [SOT89]  193.64,182.26 90 top
Q85  BA.  [SOT89]  115.35,166.13 90 top
Q86  BA.  [SOT89]  127.93,165.88 90 top
Q87  BA  [SOT89]  149.38,206.01 90 top
Q88  MY  [SOT89]  166.66,178.2 180 top
Q89  J1  [SOT-23]  179.17,181.44 270 top
Q90  J1  [SOT-23]  114.46,193.82 270 top
Q91  J1  [SOT-23]  109.97,176.76 180 top
Q92  BA  [SOT89]  198.77,204.88 0 top
Q93  J1  [SOT-23]  192.9,202.85 270 top
Q94  BA  [SOT89]  193.64,234.86 90 top
Q95  BA.  [SOT89]  115.35,218.73 90 top
Q96  BA.  [SOT89]  127.93,218.48 90 top
Q97  BA  [SOT89]  149.38,258.61 90 top
Q98  MY  [SOT89]  166.66,230.8 180 top
Q99  J1  [SOT-23]  179.17,234.04 270 top
Q100  J1  [SOT-23]  114.46,246.42 270 top
Q101  BA.  [SOT89]  31.93,8.08 90 top
Q102  BA.  [SOT89]  19.35,8.33 90 top
Q103  MY  [SOT89]  70.66,20.4 180 top
Q104  BA  [SOT89]  97.64,24.46 90 top
Q105  BA  [SOT89]  53.38,48.21 90 top
Q106  J1  [SOT-23]  18.46,36.02 270 top
Q107  J1  [SOT-23]  83.17,23.64 270 top
Q108  J1  [SOT-23]  109.97,229.36 180 top
Q109  BA  [SOT89]  198.77,257.48 0 top
Q110  J1  [SOT-23]  192.9,255.45 270 top
Q111  BA  [SOT89]  193.64,287.46 90 top
Q112  BA.  [SOT89]  115.35,271.33 90 top
Q113  BA.  [SOT89]  127.93,271.08 90 top
Q114  BA  [SOT89]  149.38,311.21 90 top
Q115  MY  [SOT89]  166.66,283.4 180 top
Q116  J1  [SOT-23]  179.17,286.64 270 top
Q117  J1  [SOT-23]  114.46,299.02 270 top
Q118  J1  [SOT-23]  109.97,281.96 180 top
Q119  BA  [SOT89]  198.77,310.08 0 top
Q120  J1  [SOT-23]  192.9,308.05 270 top
R1  104  [R0805]  26.3,51 90 top
R2  104  [R0805]  21.5,47.7 90 top
R3  104  [R0805]  24.1,44.6 90 top
R4  100  [R0805]  18.1,33.3 90 top
R5  13  [R1206]  71.2,25.8 0 top
R6  2201  [R0805]  74.36,21.6 180 top
R7  47  [V235/17_1MM]  102.15,75.41 90 bottom
R8  4701  [R0805]  99.43,48.58 180 top
R9  13  [R1206]  23.1,38.9 0 top
R10  104  [R0805]  83.37,49.99 0 top
R11  13  [R1206]  56.3,94.46 180 top
R12  100  [R0805]  94.29,32.72 0 top
R13  100  [R0805]  94.29,36.27 180 top
R14  47  [V235/17_1MM]  102.15,95.29 90 bottom
R15  104  [R0805]  91.61,97.64 90 top
R16  104  [R0805]  91.61,94.65 90 top
R17  104  [R0805]  91.61,91.48 90 top
R18  4701  [R0805]  71.67,60.68 270 top
R19  1002  [R0805]  76.5,61.19 90 top
R20  1002  [R0805]  57.7,85.95 180 top
R21  1502  [R0805]  53,60.43 0 top
R22  104  [R0805]  52.05,77.06 270 top
R23  104  [R0805]  56.75,77.06 270 top
R24  1502  [R0805]  49.7,69.06 180 top
R25  1002  [R0805]  47.03,70.4 180 top
R26  2201  [R0805]  47.03,74.97 0 top
R27  1002  [R0805]  53.45,74.84 270 top
R28  4701  [R0805]  58.72,81.13 0 top
R29  2702  [R0805]  60.88,60.43 180 top
R30  102  [R0805]  12.36,66.9 270 top
R31  47  [V235/17_1MM]  102.15,180.61 90 bottom
R32  102  [R0805]  61.51,71.6 0 top
R33  13  [R1206]  56.3,199.66 180 top
R34  47  [V235/17_1MM]  102.15,200.49 90 bottom
R35  102  [R0805]  92.88,75.67 90 top
R36  13  [R1206]  23.16,70.84 180 top
R37  13  [R1206]  26.46,66.52 180 top
R38  2702  [R0805]  55.54,60.43 0 top
R39  4701  [R0805]  77.81,73.38 270 top
R40  100  [R0805]  82.66,80.3 90 top
R41  104  [R0805]  78.53,79.35 270 top
R42  104  [R0805]  82.34,92.43 270 top
R43  104  [R0805]  91.61,202.84 90 top
R44  2702  [R0805]  71.42,87.48 270 top
R45  47  [V235/17_1MM]  96.56,75.92 90 bottom
R46  47  [V235/17_1MM]  96.56,95.8 270 bottom
R47  2702  [R0805]  78.78,94.21 270 top
R48  2201  [R0805]  70.4,81.76 90 top
R49  1002  [R0805]  37,105.64 90 top
R50  1002  [R0805]  82.1,67.28 270 top
R51  102  [R0805]  82.1,70.33 270 top
R52  2702  [R0805]  81.98,73.38 90 top
R53  1002  [R0805]  71.67,66.78 90 top
R54  1002  [R0805]  71.67,63.73 90 top
R55  R_user  [R0805']  17.84,70.33 180 top
R56  104  [R0805]  26.3,103.6 90 top
R57  104  [R0805]  21.5,100.3 90 top
R58  104  [R0805]  24.1,97.2 90 top
R59  13  [R1206]  71.2,78.4 0 top
R60  2201  [R0805]  74.36,74.2 180 top
R61  100  [R0805]  18.1,85.9 90 top
R62  13  [R1206]  23.1,91.5 0 top
R63  4701  [R0805]  99.43,101.18 180 top
R64  104  [R0805]  83.37,102.59 0 top
R65  100  [R0805]  94.29,85.32 0 top
R66  100  [R0805]  94.29,88.87 180 top
R67  47  [V235/17_1MM]  102.15,128.01 90 bottom
R68  13  [R1206]  56.3,147.06 180 top
R69  47  [V235/17_1MM]  102.15,147.89 90 bottom
R70  104  [R0805]  91.61,150.24 90 top
R71  104  [R0805]  91.61,147.25 90 top
R72  104  [R0805]  91.61,144.08 90 top
R73  4701  [R0805]  71.67,113.28 270 top
R74  1002  [R0805]  76.5,113.79 90 top
R75  1002  [R0805]  57.7,138.55 180 top
R76  1502  [R0805]  53,113.03 0 top
R77  104  [R0805]  52.05,129.66 270 top
R78  104  [R0805]  56.75,129.66 270 top
R79  1502  [R0805]  49.7,121.66 180 top
R80  1002  [R0805]  47.03,123 180 top
R81  2201  [R0805]  47.03,127.57 0 top
R82  1002  [R0805]  53.45,127.44 270 top
R83  4701  [R0805]  58.72,133.73 0 top
R84  2702  [R0805]  60.88,113.03 180 top
R85  102  [R0805]  12.36,119.5 270 top
R86  104  [R0805]  91.61,199.85 90 top
R87  102  [R0805]  61.51,124.2 0 top
R88  104  [R0805]  91.61,196.68 90 top
R89  4701  [R0805]  71.67,165.88 270 top
R90  102  [R0805]  92.88,128.27 90 top
R91  13  [R1206]  23.16,123.44 180 top
R92  13  [R1206]  26.46,119.12 180 top
R93  2702  [R0805]  55.54,113.03 0 top
R94  4701  [R0805]  77.81,125.98 270 top
R95  100  [R0805]  82.66,132.9 90 top
R96  104  [R0805]  78.53,131.95 270 top
R97  104  [R0805]  82.34,145.03 270 top
R98  1002  [R0805]  76.5,166.39 90 top
R99  2702  [R0805]  71.42,140.08 270 top
R100  47  [V235/17_1MM]  96.56,128.52 90 bottom
R101  102  [R0805]  12.36,14.3 270 top
R102  13  [R1206]  26.46,13.92 180 top
R103  R_user  [R0805']  17.84,17.73 180 top
R104  1002  [R0805]  57.7,191.15 180 top
R105  4701  [R0805]  71.67,8.08 270 top
R106  13  [R1206]  23.16,18.24 180 top
R107  1002  [R0805]  76.5,8.59 90 top
R108  1002  [R0805]  82.1,14.68 270 top
R109  104  [R0805]  91.61,45.04 90 top
R110  104  [R0805]  91.61,42.05 90 top
R111  104  [R0805]  91.61,38.88 90 top
R112  102  [R0805]  82.1,17.73 270 top
R113  1002  [R0805]  71.67,14.18 90 top
R114  1002  [R0805]  71.67,11.13 90 top
R115  102  [R0805]  61.51,19 0 top
R116  4701  [R0805]  77.81,20.78 270 top
R117  2702  [R0805]  81.98,20.78 90 top
R118  47  [V235/17_1MM]  96.56,148.4 270 bottom
R119  2201  [R0805]  70.4,29.16 90 top
R120  1002  [R0805]  57.7,33.35 180 top
R121  1502  [R0805]  53,7.83 0 top
R122  2702  [R0805]  55.54,7.83 0 top
R123  2702  [R0805]  60.88,7.83 180 top
R124  1002  [R0805]  53.45,22.24 270 top
R125  104  [R0805]  52.05,24.46 270 top
R126  4701  [R0805]  58.72,28.53 0 top
R127  47  [V235/17_1MM]  102.15,22.81 90 bottom
R128  102  [R0805]  92.88,23.07 90 top
R129  47  [V235/17_1MM]  102.15,42.69 90 bottom
R130  104  [R0805]  56.75,24.46 270 top
R131  1502  [R0805]  49.7,16.46 180 top
R132  1002  [R0805]  47.03,17.8 180 top
R133  2201  [R0805]  47.03,22.37 0 top
R134  13  [R1206]  56.3,41.86 180 top
R135  104  [R0805]  78.53,26.75 270 top
R136  47  [V235/17_1MM]  96.56,23.32 90 bottom
R137  47  [V235/17_1MM]  96.56,43.2 270 bottom
R138  100  [R0805]  82.66,27.7 90 top
R139  2702  [R0805]  78.78,146.81 270 top
R140  2702  [R0805]  71.42,34.88 270 top
R141  104  [R0805]  82.34,39.83 270 top
R142  1502  [R0805]  53,165.63 0 top
R143  104  [R0805]  52.05,182.26 270 top
R144  104  [R0805]  56.75,182.26 270 top
R145  2702  [R0805]  78.78,41.61 270 top
R146  1002  [R0805]  37,53.04 90 top
R147  2201  [R0805]  70.4,134.36 90 top
R148  1002  [R0805]  37,158.24 90 top
R149  1002  [R0805]  82.1,119.88 270 top
R150  102  [R0805]  82.1,122.93 270 top
R151  2702  [R0805]  81.98,125.98 90 top
R152  1002  [R0805]  71.67,119.38 90 top
R153  1002  [R0805]  71.67,116.33 90 top
R154  R_user  [R0805']  17.84,122.93 180 top
R155  104  [R0805]  26.3,156.2 90 top
R156  104  [R0805]  21.5,152.9 90 top
R157  104  [R0805]  24.1,149.8 90 top
R158  13  [R1206]  71.2,131 0 top
R159  2201  [R0805]  74.36,126.8 180 top
R160  100  [R0805]  18.1,138.5 90 top
R161  13  [R1206]  23.1,144.1 0 top
R162  4701  [R0805]  99.43,153.78 180 top
R163  104  [R0805]  83.37,155.19 0 top
R164  100  [R0805]  94.29,137.92 0 top
R165  100  [R0805]  94.29,141.47 180 top
R166  47  [V235/17_1MM]  198.15,22.81 90 bottom
R167  13  [R1206]  152.3,41.86 180 top
R168  47  [V235/17_1MM]  198.15,42.69 90 bottom
R169  104  [R0805]  187.61,45.04 90 top
R170  104  [R0805]  187.61,42.05 90 top
R171  104  [R0805]  187.61,38.88 90 top
R172  4701  [R0805]  167.67,8.08 270 top
R173  1002  [R0805]  172.5,8.59 90 top
R174  1002  [R0805]  153.7,33.35 180 top
R175  1502  [R0805]  149,7.83 0 top
R176  104  [R0805]  148.05,24.46 270 top
R177  104  [R0805]  152.75,24.46 270 top
R178  1502  [R0805]  145.7,16.46 180 top
R179  1002  [R0805]  143.03,17.8 180 top
R180  2201  [R0805]  143.03,22.37 0 top
R181  1002  [R0805]  149.45,22.24 270 top
R182  4701  [R0805]  154.72,28.53 0 top
R183  2702  [R0805]  156.88,7.83 180 top
R184  102  [R0805]  108.36,14.3 270 top
R185  1502  [R0805]  49.7,174.26 180 top
R186  102  [R0805]  157.51,19 0 top
R187  1002  [R0805]  47.03,175.6 180 top
R188  2201  [R0805]  47.03,180.17 0 top
R189  102  [R0805]  188.88,23.07 90 top
R190  13  [R1206]  119.16,18.24 180 top
R191  13  [R1206]  122.46,13.92 180 top
R192  2702  [R0805]  151.54,7.83 0 top
R193  4701  [R0805]  173.81,20.78 270 top
R194  100  [R0805]  178.66,27.7 90 top
R195  104  [R0805]  174.53,26.75 270 top
R196  104  [R0805]  178.34,39.83 270 top
R197  1002  [R0805]  53.45,180.04 270 top
R198  2702  [R0805]  167.42,34.88 270 top
R199  47  [V235/17_1MM]  192.56,23.32 90 bottom
R200  47  [V235/17_1MM]  192.56,43.2 270 bottom
R201  2702  [R0805]  174.78,41.61 270 top
R202  2201  [R0805]  166.4,29.16 90 top
R203  1002  [R0805]  133,53.04 90 top
R204  1002  [R0805]  178.1,14.68 270 top
R205  102  [R0805]  178.1,17.73 270 top
R206  2702  [R0805]  177.98,20.78 90 top
R207  1002  [R0805]  167.67,14.18 90 top
R208  1002  [R0805]  167.67,11.13 90 top
R209  R_user  [R0805']  113.84,17.73 180 top
R210  104  [R0805]  122.3,51 90 top
R211  104  [R0805]  117.5,47.7 90 top
R212  104  [R0805]  120.1,44.6 90 top
R213  13  [R1206]  167.2,25.8 0 top
R214  2201  [R0805]  170.36,21.6 180 top
R215  100  [R0805]  114.1,33.3 90 top
R216  13  [R1206]  119.1,38.9 0 top
R217  4701  [R0805]  195.43,48.58 180 top
R218  104  [R0805]  179.37,49.99 0 top
R219  100  [R0805]  190.29,32.72 0 top
R220  100  [R0805]  190.29,36.27 180 top
R221  47  [V235/17_1MM]  198.15,75.41 90 bottom
R222  13  [R1206]  152.3,94.46 180 top
R223  47  [V235/17_1MM]  198.15,95.29 90 bottom
R224  104  [R0805]  187.61,97.64 90 top
R225  104  [R0805]  187.61,94.65 90 top
R226  104  [R0805]  187.61,91.48 90 top
R227  4701  [R0805]  167.67,60.68 270 top
R228  1002  [R0805]  172.5,61.19 90 top
R229  1002  [R0805]  153.7,85.95 180 top
R230  1502  [R0805]  149,60.43 0 top
R231  104  [R0805]  148.05,77.06 270 top
R232  104  [R0805]  152.75,77.06 270 top
R233  1502  [R0805]  145.7,69.06 180 top
R234  1002  [R0805]  143.03,70.4 180 top
R235  2201  [R0805]  143.03,74.97 0 top
R236  1002  [R0805]  149.45,74.84 270 top
R237  4701  [R0805]  154.72,81.13 0 top
R238  2702  [R0805]  156.88,60.43 180 top
R239  102  [R0805]  108.36,66.9 270 top
R240  4701  [R0805]  58.72,186.33 0 top
R241  102  [R0805]  157.51,71.6 0 top
R242  2702  [R0805]  60.88,165.63 180 top
R243  102  [R0805]  12.36,172.1 270 top
R244  102  [R0805]  188.88,75.67 90 top
R245  13  [R1206]  119.16,70.84 180 top
R246  13  [R1206]  122.46,66.52 180 top
R247  2702  [R0805]  151.54,60.43 0 top
R248  4701  [R0805]  173.81,73.38 270 top
R249  100  [R0805]  178.66,80.3 90 top
R250  104  [R0805]  174.53,79.35 270 top
R251  104  [R0805]  178.34,92.43 270 top
R252  102  [R0805]  61.51,176.8 0 top
R253  2702  [R0805]  167.42,87.48 270 top
R254  47  [V235/17_1MM]  192.56,75.92 90 bottom
R255  47  [V235/17_1MM]  192.56,95.8 270 bottom
R256  2702  [R0805]  174.78,94.21 270 top
R257  2201  [R0805]  166.4,81.76 90 top
R258  1002  [R0805]  133,105.64 90 top
R259  1002  [R0805]  178.1,67.28 270 top
R260  102  [R0805]  178.1,70.33 270 top
R261  2702  [R0805]  177.98,73.38 90 top
R262  1002  [R0805]  167.67,66.78 90 top
R263  1002  [R0805]  167.67,63.73 90 top
R264  R_user  [R0805']  113.84,70.33 180 top
R265  104  [R0805]  122.3,103.6 90 top
R266  104  [R0805]  117.5,100.3 90 top
R267  104  [R0805]  120.1,97.2 90 top
R268  13  [R1206]  167.2,78.4 0 top
R269  2201  [R0805]  170.36,74.2 180 top
R270  100  [R0805]  114.1,85.9 90 top
R271  13  [R1206]  119.1,91.5 0 top
R272  4701  [R0805]  195.43,101.18 180 top
R273  104  [R0805]  179.37,102.59 0 top
R274  100  [R0805]  190.29,85.32 0 top
R275  100  [R0805]  190.29,88.87 180 top
R276  47  [V235/17_1MM]  198.15,128.01 90 bottom
R277  13  [R1206]  152.3,147.06 180 top